# EAGLE design f1042 (EAGLE 7.5.1)
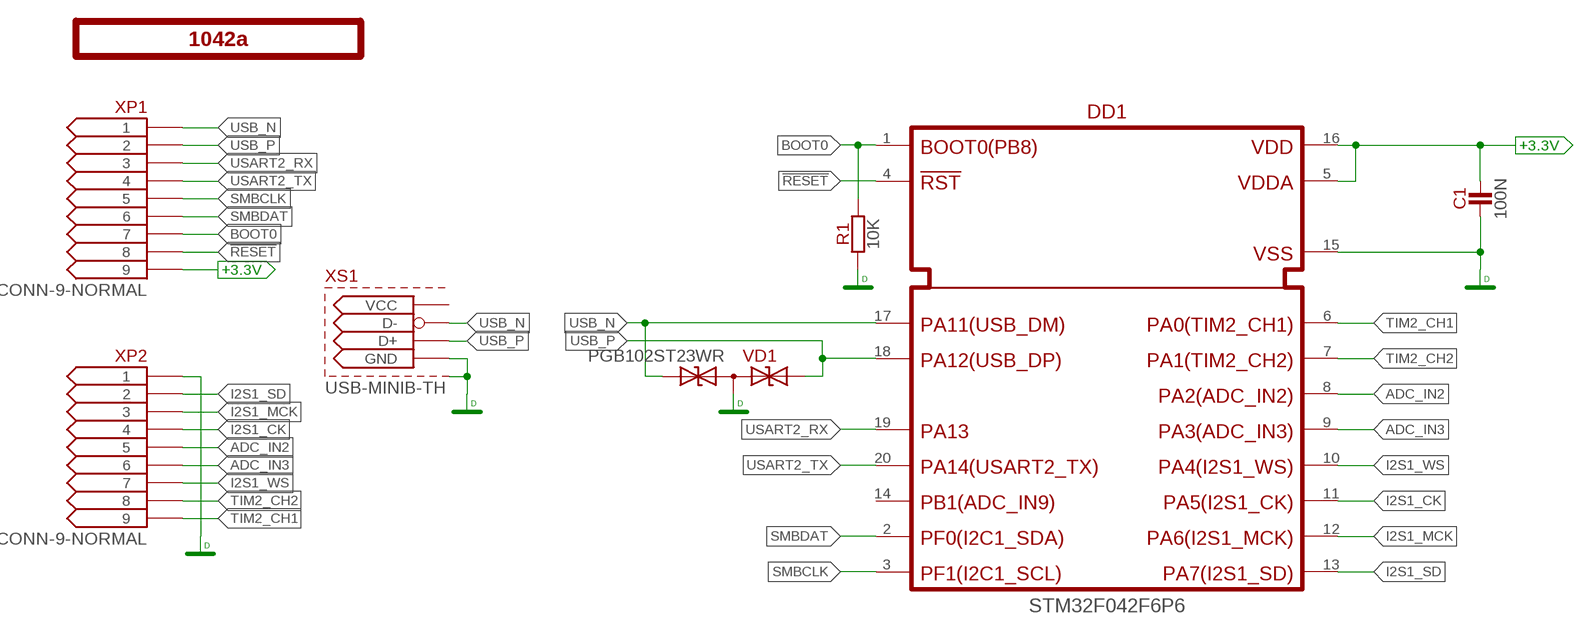
[diagram p0: schematic, sheet 1]

## Parts
C1  100N  [C-0805]
DD1  STM32F042F6P6  [TSSOP20]
PCB1  1042a  GENERIC-LOGO  [F-LOGO]
R1  10K  [R-0805]
VD1  PGB102ST23WR  [SOT23]
XP1  CONN-9-NORMAL  [MA03-9]
XP2  CONN-9-NORMAL  [MA03-9]
XS1  USB-MINIB-TH  [USB-MB-H]

## Nets
!RESET: DD1.4(!RST) XP1.8
+3.3V: C1.2 DD1.5(VDDA) DD1.16(VDD) XP1.9
ADC_IN2: DD1.8(PA2) XP2.5
ADC_IN3: DD1.9(PA3) XP2.6
BOOT0: DD1.1(BOOT0) R1.2 XP1.7
DGND: C1.1 DD1.15(VSS) R1.1 VD1.3(C) XP2.1 XS1.GND XS1.P$1(S1) XS1.P$2(S1) XS1.P$6(S1) XS1.P$7(S1)
I2S1_CK: DD1.11(PA5) XP2.4
I2S1_MCK: DD1.12(PA6) XP2.3
I2S1_SD: DD1.13(PA7) XP2.2
I2S1_WS: DD1.10(PA4) XP2.7
SMBCLK: DD1.3(PF1) XP1.5
SMBDAT: DD1.2(PF0) XP1.6
TIM2_CH1: DD1.6(PA0) XP2.9
TIM2_CH2: DD1.7(PA1) XP2.8
USART2_RX: DD1.19(PA13) XP1.3
USART2_TX: DD1.20(PA14) XP1.4
USB_N: DD1.17(PA11) VD1.2(A1) XP1.1 XS1.D-
USB_P: DD1.18(PA12) VD1.1(A) XP1.2 XS1.D+
Unconnected: DD1.14(PB1) XS1.VBUS(VCC)

## Library data of the parts
C1 = capacitors:?; MOUSER: 77-VJ0805V104MXBPBC
DD1 = ic-stm:STM32F042F6P6; MOUSER: 511-STM32F042F6P6
PCB1 = module-footprints:GENERIC
R1 = resistors:?; MOUSER: 660-RK73H2ATTD1002F
VD1 = diodes-zener:PGB102ST23WR; MOUSER: 576-PGB102ST23WR
XP1 XP2 = connectors:CONN-9-?
XS1 = connectors:USB-MINIB-TH

## Board
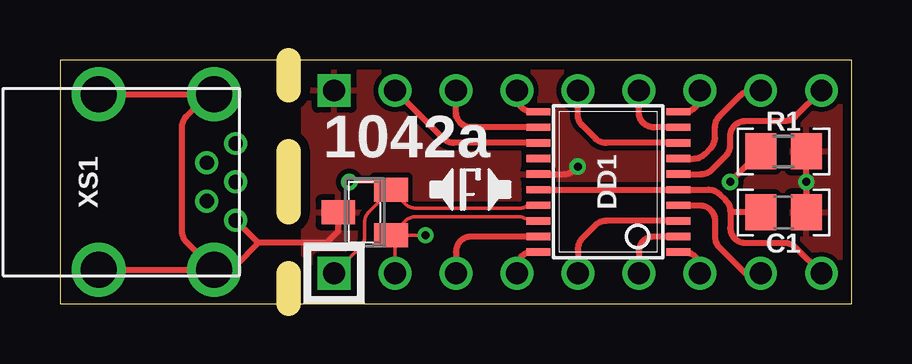
[diagram p1: board, top side]
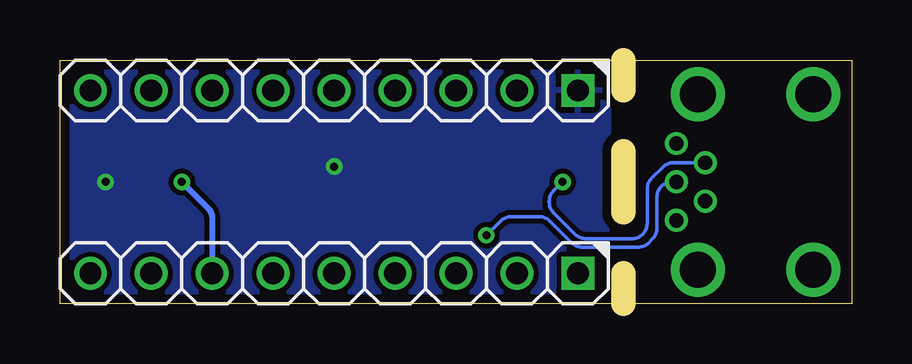
[diagram p2: board, bottom side, seen from below]

Size 33.02 x 10.16 mm. Coordinates in mm from the lower left corner, seen from the top.
Outline: 9.53,0 0,0 0,10.16 9.53,10.16
Outline: 9.53,0 33.02,0 33.02,10.16 9.53,10.16
Outline: 9.53,8.89 9.53,10.16
Outline: 9.53,0 9.53,1.27
Outline: 9.53,3.81 9.53,6.35
Copper layers (1*16): Top 0.0356mm / dielectric 1.5011mm / Bottom 0.0356mm
Design rules "sonictrain": minimum track width 6mil, minimum drill 13mil, track to track 8mil, track to pad 8mil, pad to pad 6mil, via to via 6mil, smd to smd 6mil, copper to edge 15mil, drill to drill 6mil, minimum pad ring 7mil, minimum via ring 7mil, stop-mask expansion 3mil, vias tented up to drill 25mil, thermal gap 10mil

### Footprints (pad centres in the part's own frame; a part is rotated, then mirrored left to right if it is on the bottom)
C-0805 = smd 1.3 x 1.5: 1 -0.95,0; 2 0.95,0
TSSOP20 = smd 0.305 x 0.991: 1 -2.925,-2.918; 2 -2.275,-2.918; 3 -1.625,-2.918; 4 -0.975,-2.918; 5 -0.325,-2.918; 6 0.325,-2.918; 7 0.975,-2.918; 8 1.625,-2.918; 9 2.275,-2.918; 10 2.925,-2.918; 11 2.925,2.918; 12 2.275,2.918; 13 1.625,2.918; 14 0.975,2.918; 15 0.325,2.918; 16 -0.325,2.918; 17 -0.975,2.918; 18 -1.625,2.918; 19 -2.275,2.918; 20 -2.925,2.918
R-0805 = smd 1.3 x 1.5: 1 -0.95,0; 2 0.95,0
SOT23 = smd 1 x 1.4: 1 -0.95,-1.1; 2 0.95,-1.1; 3 0,1.1
MA03-9 = drill 0.914 square: 1 0,0 | drill 0.914: 2 2.54,0; 3 5.08,0; 4 7.62,0; 5 10.16,0; 6 12.7,0; 7 15.24,0; 8 17.78,0; 9 20.32,0
USB-MB-H = drill 0.6: D+ 5.1,0; D- 3.9,0.8; GND 5.1,-1.6; ID 3.9,-0.8; VBUS 5.1,1.6 | drill 1.5: P$1 4.2,3.65; P$2 4.2,-3.65; P$6 -0.6,-3.65; P$7 -0.6,3.65

### Placement (x,y rotation side)
C1  30.16,3.81 180 top
DD1  22.86,5.08 90 top
PCB1  17.14,5.08 0 top
R1  30.16,6.35 180 top
VD1  12.7,3.81 90 top
XP1  11.43,1.27 180 bottom
XP2  11.43,8.89 180 bottom
XS1  2.22,5.08 0 top

### Tracks (layer width: path | path; a pad name or v marks a point on that pad's centre or on a via)
!RESET
  Top 0.254: DD1.4 26.67,4.11 arc-90 27.3,3.47 27.3,2.8 arc45 27.49,2.35 28.57,1.27 XP1.8
+3.3V
  Top 0.254: 27.94,3.86 arc45 27.75,4.31 27.5,4.57 arc45 27.05,4.75 DD1.5 DD1.16 | 27.94,3.86 27.94,3.17 arc90 28.57,2.54 30.22,2.54 arc-45 30.67,2.35 XP1.9 | C1.2 28.07,3.81 arc-45 27.94,3.86
ADC_IN2
  Top 0.254: DD1.8 22.77,6.71 arc-45 22.32,6.89 21.78,7.43 arc-45 21.59,7.88 XP2.5
ADC_IN3
  Top 0.254: DD1.9 24.77,7.36 arc-90 24.13,7.99 XP2.6
BOOT0  (via drill 0.33)
  Top 0.254: DD1.1 26.04,2.15 arc-90 26.67,1.52 XP1.7 | v27.94,5.08 arc45 v27.94,5.08 R1.2
  Bottom 0.254: v27.94,5.08 26.86,4 arc45 26.67,3.55 XP1.7
DGND  (via drill 0.33)
  Top 0.254: VD1.3 11.6,3.03 11.11,2.54 8.26,2.54 | 8.26,2.54 XS1.GND | XS1.P$6 XS1.P$2 | XS1.P$2 6.89,1.43 arc45 7.34,1.62 8.26,2.54 | XS1.P$7 XS1.P$1 arc45 6.03,8.57 5.27,7.81 arc45 5.08,7.36 5.08,3.04 arc45 5.27,2.59 XS1.P$2 | DD1.15 21.02,5.41 arc45 21.47,5.59 v21.59,5.71 | R1.1 arc-45 R1.1 v31.11,5.08 C1.1 arc-45 C1.1
  pour Bottom: 10.16,10.16 33.02,10.16 33.02,0 10.16,0
  pour Top: 10.16,10.16 10.16,0 33.02,0 33.02,10.16
I2S1_CK
  Top 0.254: DD1.11 19.68,8.01 arc-90 19.05,8.64 XP2.4
I2S1_MCK
  Top 0.254: DD1.12 17.14,7.36 arc-90 16.51,7.99 XP2.3
I2S1_SD
  Top 0.254: DD1.13 16.42,6.71 arc-45 15.97,6.89 XP2.2
I2S1_WS
  Top 0.254: DD1.10 26.04,8.01 arc90 26.67,8.64 XP2.7
SMBCLK
  Top 0.254: DD1.3 22.77,3.46 arc45 22.32,3.27 21.78,2.73 arc45 21.59,2.28 XP1.5
SMBDAT
  Top 0.254: DD1.2 24.77,2.81 arc90 24.13,2.17 XP1.6
TIM2_CH1
  Top 0.254: DD1.6 26.73,5.41 arc45 27.18,5.59 27.75,6.16 arc45 27.94,6.61 27.94,6.99 arc-90 28.57,7.62 30.22,7.62 arc45 30.67,7.81 XP2.9
TIM2_CH2
  Top 0.254: DD1.7 26.43,6.05 arc45 26.88,6.24 27.12,6.48 arc45 27.3,6.93 27.3,7.36 arc-45 27.49,7.81 28.39,8.7 arc-45 28.84,8.89 XP2.8
USART2_RX
  Top 0.254: DD1.19 17.14,2.81 arc90 16.51,2.17 XP1.3
USART2_TX
  Top 0.254: DD1.20 19.68,2.15 arc90 19.05,1.52 XP1.4
USB_N  (via drill 0.33)
  Top 0.152: DD1.17 19.48,4.11 arc-45 19.2,3.99 14.84,3.99 arc-45 14.39,4.17 VD1.2 | XP1.1 12.51,2.35 arc45 12.7,2.8 12.7,3.4 arc-45 12.89,3.85 VD1.2 | v12.06,5.08 13.48,5.08 VD1.2
  Bottom 0.152: v12.06,5.08 12.44,4.71 arc-45 12.63,4.26 12.63,4.25 arc-45 12.44,3.8 11.54,2.9 arc-45 11.09,2.72 9.17,2.72 arc-90 8.54,3.35 8.54,4.78 arc45 8.35,5.23 7.89,5.69 arc45 7.44,5.88 XS1.D-
USB_P  (via drill 0.33)
  Top 0.152: DD1.18 19.55,3.46 arc45 19.12,3.63 14.84,3.63 arc45 14.39,3.45 VD1.1 | XP1.2 13.97,2.69 VD1.1 | v15.24,2.86 VD1.1
  Bottom 0.152: v15.24,2.86 14.65,3.45 arc45 14.2,3.63 13.04,3.63 arc45 12.59,3.45 11.69,2.55 arc-45 11.24,2.36 8.92,2.36 arc-45 8.47,2.55 8.31,2.71 arc-45 8.13,3.15 8.13,4.45 arc90 7.49,5.08 XS1.D+